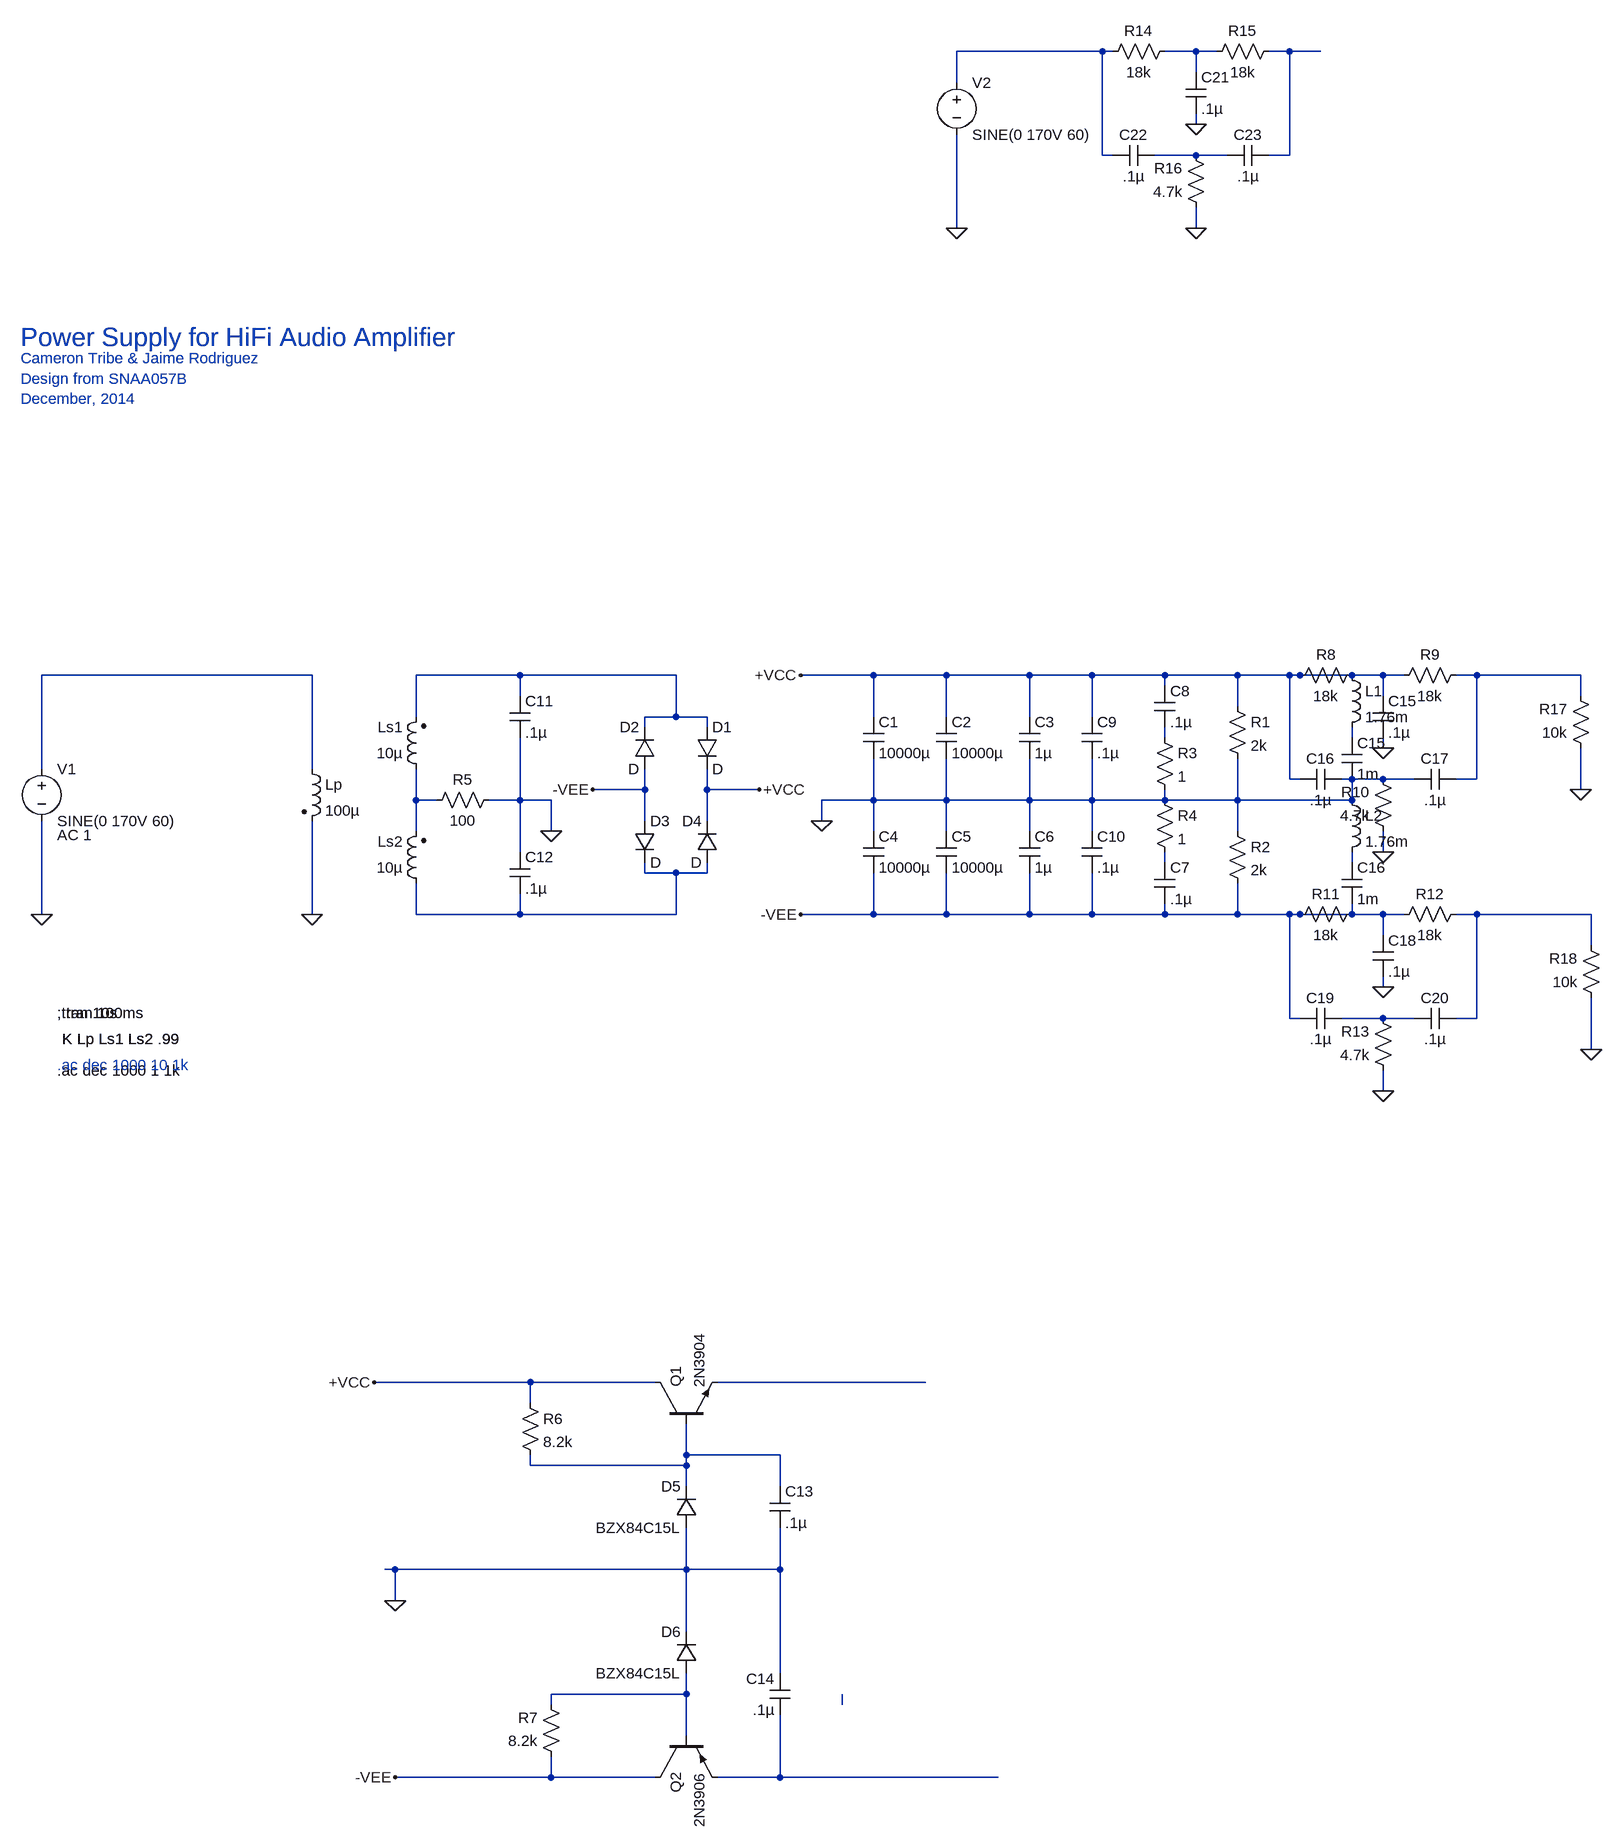
[diagram p0: schematic Power Supply.asc]
Power Supply.asc, the LTspice schematic file:
Version 4
<<<<<<< Updated upstream
SHEET 1 2192 1984
=======
SHEET 1 2484 1984
WIRE 1712 -784 1488 -784
WIRE 1728 -784 1712 -784
WIRE 1856 -784 1808 -784
WIRE 1888 -784 1856 -784
WIRE 2000 -784 1968 -784
WIRE 2048 -784 2000 -784
WIRE 1856 -752 1856 -784
WIRE 1488 -736 1488 -784
WIRE 1856 -672 1856 -688
WIRE 1712 -624 1712 -784
WIRE 1728 -624 1712 -624
WIRE 1856 -624 1792 -624
WIRE 1904 -624 1856 -624
WIRE 2000 -624 2000 -784
WIRE 2000 -624 1968 -624
WIRE 1488 -512 1488 -656
WIRE 1856 -512 1856 -544
>>>>>>> Stashed changes
WIRE 496 176 80 176
WIRE 816 176 656 176
WIRE 1056 176 816 176
WIRE 1360 176 1248 176
WIRE 1472 176 1360 176
WIRE 1600 176 1472 176
WIRE 1696 176 1600 176
WIRE 1808 176 1696 176
WIRE 1920 176 1808 176
<<<<<<< Updated upstream
WIRE 2096 176 1920 176
=======
WIRE 2000 176 1920 176
WIRE 2016 176 2000 176
WIRE 2144 176 2096 176
WIRE 2176 176 2144 176
WIRE 2288 176 2256 176
WIRE 2448 176 2288 176
>>>>>>> Stashed changes
WIRE 1808 192 1808 176
WIRE 816 208 816 176
WIRE 2144 208 2144 176
WIRE 2448 208 2448 176
WIRE 1920 224 1920 176
WIRE 656 240 656 176
WIRE 1056 240 1056 176
WIRE 1056 240 1008 240
WIRE 1104 240 1056 240
WIRE 1360 240 1360 176
WIRE 1472 240 1472 176
WIRE 1600 240 1600 176
WIRE 1696 240 1696 176
WIRE 1008 256 1008 240
WIRE 1104 256 1104 240
WIRE 1808 272 1808 256
<<<<<<< Updated upstream
WIRE 2096 272 2096 256
=======
WIRE 2144 288 2144 272
>>>>>>> Stashed changes
WIRE 80 320 80 176
WIRE 496 320 496 176
WIRE 2000 336 2000 176
WIRE 2016 336 2000 336
WIRE 2144 336 2080 336
WIRE 2192 336 2144 336
WIRE 2288 336 2288 176
WIRE 2288 336 2256 336
WIRE 1008 352 1008 320
WIRE 1008 352 928 352
WIRE 1104 352 1104 320
WIRE 1184 352 1104 352
WIRE 2448 352 2448 288
WIRE 656 368 656 320
WIRE 688 368 656 368
WIRE 816 368 816 272
WIRE 816 368 768 368
WIRE 864 368 816 368
WIRE 1360 368 1360 304
WIRE 1360 368 1280 368
WIRE 1472 368 1472 304
WIRE 1472 368 1360 368
WIRE 1600 368 1600 304
WIRE 1600 368 1472 368
WIRE 1696 368 1696 304
WIRE 1696 368 1600 368
WIRE 1808 368 1808 352
WIRE 1808 368 1696 368
WIRE 1920 368 1920 304
WIRE 1920 368 1808 368
<<<<<<< Updated upstream
WIRE 2016 368 1920 368
WIRE 2096 368 2096 336
WIRE 2096 368 2016 368
=======
>>>>>>> Stashed changes
WIRE 1008 400 1008 352
WIRE 1104 400 1104 352
WIRE 1280 400 1280 368
WIRE 656 416 656 368
WIRE 864 416 864 368
WIRE 1360 416 1360 368
WIRE 1472 416 1472 368
WIRE 1600 416 1600 368
WIRE 1696 416 1696 368
WIRE 1920 416 1920 368
WIRE 816 448 816 368
WIRE 2144 448 2144 416
WIRE 1808 464 1808 448
WIRE 2096 464 2096 448
WIRE 1008 480 1008 464
WIRE 1056 480 1008 480
WIRE 1104 480 1104 464
WIRE 1104 480 1056 480
WIRE 80 544 80 400
WIRE 496 544 496 400
WIRE 656 544 656 496
WIRE 816 544 816 512
WIRE 816 544 656 544
WIRE 1056 544 1056 480
WIRE 1056 544 816 544
WIRE 1360 544 1360 480
WIRE 1360 544 1248 544
WIRE 1472 544 1472 480
WIRE 1472 544 1360 544
WIRE 1600 544 1600 480
WIRE 1600 544 1472 544
WIRE 1696 544 1696 480
WIRE 1696 544 1600 544
WIRE 1808 544 1808 528
WIRE 1808 544 1696 544
WIRE 1920 544 1920 496
WIRE 1920 544 1808 544
<<<<<<< Updated upstream
WIRE 2096 544 2096 528
WIRE 2096 544 1920 544
=======
WIRE 2000 544 1920 544
WIRE 2016 544 2000 544
WIRE 2144 544 2096 544
WIRE 2176 544 2144 544
WIRE 2288 544 2256 544
WIRE 2464 544 2288 544
WIRE 2144 576 2144 544
WIRE 2464 592 2464 544
WIRE 2144 656 2144 640
WIRE 2000 704 2000 544
WIRE 2016 704 2000 704
WIRE 2144 704 2080 704
WIRE 2192 704 2144 704
WIRE 2288 704 2288 544
WIRE 2288 704 2256 704
WIRE 2464 752 2464 672
WIRE 2144 816 2144 784
>>>>>>> Stashed changes
WIRE 832 1264 592 1264
WIRE 1024 1264 832 1264
WIRE 1440 1264 1120 1264
WIRE 832 1296 832 1264
WIRE 1072 1376 1072 1328
WIRE 1216 1376 1072 1376
WIRE 832 1392 832 1376
WIRE 1072 1392 1072 1376
WIRE 1072 1392 832 1392
WIRE 1072 1424 1072 1392
WIRE 1216 1424 1216 1376
WIRE 624 1552 608 1552
WIRE 1072 1552 1072 1488
WIRE 1072 1552 624 1552
WIRE 1216 1552 1216 1488
WIRE 1216 1552 1072 1552
WIRE 624 1600 624 1552
WIRE 1072 1648 1072 1552
WIRE 1216 1712 1216 1552
WIRE 1072 1744 1072 1712
WIRE 1072 1744 864 1744
WIRE 864 1760 864 1744
WIRE 1312 1760 1312 1744
WIRE 1072 1808 1072 1744
WIRE 864 1872 864 1840
WIRE 864 1872 624 1872
WIRE 1024 1872 864 1872
WIRE 1216 1872 1216 1776
WIRE 1216 1872 1120 1872
WIRE 1552 1872 1216 1872
FLAG 1184 352 +VCC
FLAG 928 352 -VEE
FLAG 1248 176 +VCC
FLAG 1248 544 -VEE
FLAG 80 544 0
FLAG 496 544 0
FLAG 864 416 0
FLAG 592 1264 +VCC
FLAG 624 1872 -VEE
FLAG 624 1600 0
FLAG 1280 400 0
FLAG 1856 -672 0
FLAG 1856 -512 0
FLAG 1488 -512 0
FLAG 2144 288 0
FLAG 2144 448 0
FLAG 2144 656 0
FLAG 2144 816 0
FLAG 2448 352 0
FLAG 2464 752 0
SYMBOL voltage 80 304 R0
WINDOW 123 24 118 Left 2
SYMATTR InstName V1
SYMATTR Value SINE(0 170V 60)
SYMATTR SpiceLine Rser=.00001
SYMATTR Value2 AC 1
SYMBOL diode 1088 256 R0
SYMATTR InstName D1
SYMBOL diode 1024 320 R180
WINDOW 0 24 64 Left 2
WINDOW 3 24 0 Left 2
SYMATTR InstName D2
SYMBOL diode 992 400 R0
SYMATTR InstName D3
SYMBOL diode 1120 464 R180
WINDOW 0 24 64 Left 2
WINDOW 3 24 0 Left 2
SYMATTR InstName D4
SYMBOL ind2 480 304 R0
SYMATTR InstName Lp
SYMATTR Value 100µ
SYMATTR Type ind
SYMBOL ind2 672 336 R180
WINDOW 0 36 80 Left 2
WINDOW 3 36 40 Left 2
SYMATTR InstName Ls1
SYMATTR Value 10µ
SYMATTR Type ind
SYMBOL ind2 672 512 R180
WINDOW 0 36 80 Left 2
WINDOW 3 36 40 Left 2
SYMATTR InstName Ls2
SYMATTR Value 10µ
SYMATTR Type ind
SYMBOL cap 1344 240 R0
SYMATTR InstName C1
SYMATTR Value 10000µ
SYMBOL cap 1456 240 R0
SYMATTR InstName C2
SYMATTR Value 10000µ
SYMBOL cap 1584 240 R0
SYMATTR InstName C3
SYMATTR Value 1µ
SYMBOL cap 1344 416 R0
SYMATTR InstName C4
SYMATTR Value 10000µ
SYMBOL cap 1456 416 R0
SYMATTR InstName C5
SYMATTR Value 10000µ
SYMBOL cap 1584 416 R0
SYMATTR InstName C6
SYMATTR Value 1µ
SYMBOL cap 1792 464 R0
SYMATTR InstName C7
SYMATTR Value .1µ
SYMBOL cap 1792 192 R0
SYMATTR InstName C8
SYMATTR Value .1µ
SYMBOL res 1904 208 R0
SYMATTR InstName R1
SYMATTR Value 2k
SYMBOL res 1904 400 R0
SYMATTR InstName R2
SYMATTR Value 2k
SYMBOL res 1792 256 R0
SYMATTR InstName R3
SYMATTR Value 1
SYMBOL res 1792 352 R0
SYMATTR InstName R4
SYMATTR Value 1
SYMBOL cap 1680 240 R0
SYMATTR InstName C9
SYMATTR Value .1µ
SYMBOL cap 1680 416 R0
SYMATTR InstName C10
SYMATTR Value .1µ
SYMBOL res 784 352 R90
WINDOW 0 0 56 VBottom 2
WINDOW 3 32 56 VTop 2
SYMATTR InstName R5
SYMATTR Value 100
SYMBOL cap 800 208 R0
SYMATTR InstName C11
SYMATTR Value .1µ
SYMBOL cap 800 448 R0
SYMATTR InstName C12
SYMATTR Value .1µ
SYMBOL res 816 1280 R0
SYMATTR InstName R6
SYMATTR Value 8.2k
SYMBOL npn 1024 1328 R270
SYMATTR InstName Q1
SYMATTR Value 2N3904
SYMBOL diode 1088 1488 R180
WINDOW 0 24 64 Left 2
WINDOW 3 24 0 Left 2
SYMATTR InstName D5
SYMATTR Value BZX84C15L
SYMBOL cap 1200 1424 R0
SYMATTR InstName C13
SYMATTR Value .1µ
SYMBOL res 880 1856 R180
WINDOW 0 36 76 Left 2
WINDOW 3 36 40 Left 2
SYMATTR InstName R7
SYMATTR Value 8.2k
SYMBOL diode 1088 1712 R180
WINDOW 0 24 64 Left 2
WINDOW 3 24 0 Left 2
SYMATTR InstName D6
SYMATTR Value BZX84C15L
SYMBOL cap 1232 1776 R180
WINDOW 0 24 56 Left 2
WINDOW 3 24 8 Left 2
SYMATTR InstName C14
SYMATTR Value .1µ
SYMBOL pnp 1024 1808 M90
SYMATTR InstName Q2
SYMATTR Value 2N3906
<<<<<<< Updated upstream
SYMBOL cap 2080 272 R0
SYMATTR InstName C15
SYMATTR Value 1m
SYMBOL ind 2080 160 R0
SYMATTR InstName L1
SYMATTR Value 1.76m
SYMBOL cap 2080 464 R0
SYMATTR InstName C16
SYMATTR Value 1m
SYMBOL ind 2080 352 R0
SYMATTR InstName L2
SYMATTR Value 1.76m
TEXT 112 736 Left 2 !K Lp Ls1 Ls2 .99
TEXT 104 696 Left 2 !;.tran 100ms
TEXT 48 -344 Left 4 ;Power Supply for HiFi Audio Amplifier
TEXT 48 -312 Left 2 ;Cameron Tribe & Jaime Rodriguez\nDesign from SNAA057B\nDecember, 2014
TEXT 104 784 Left 2 !.ac dec 1000 1 1k
=======
SYMBOL res 1824 -800 R90
WINDOW 0 0 56 VBottom 2
WINDOW 3 32 56 VTop 2
SYMATTR InstName R14
SYMATTR Value 18k
SYMBOL res 1984 -800 R90
WINDOW 0 0 56 VBottom 2
WINDOW 3 32 56 VTop 2
SYMATTR InstName R15
SYMATTR Value 18k
SYMBOL res 1872 -528 R180
WINDOW 0 36 76 Left 2
WINDOW 3 36 40 Left 2
SYMATTR InstName R16
SYMATTR Value 4.7k
SYMBOL cap 1840 -752 R0
SYMATTR InstName C21
SYMATTR Value .1µ
SYMBOL cap 1792 -640 R90
WINDOW 0 0 32 VBottom 2
WINDOW 3 32 32 VTop 2
SYMATTR InstName C22
SYMATTR Value .1µ
SYMBOL cap 1968 -640 R90
WINDOW 0 0 32 VBottom 2
WINDOW 3 32 32 VTop 2
SYMATTR InstName C23
SYMATTR Value .1µ
SYMBOL voltage 1488 -752 R0
SYMATTR InstName V2
SYMATTR Value SINE(0 170V 60)
SYMATTR SpiceLine Rser=.00001
SYMATTR Value2 AC 1
SYMBOL res 2112 160 R90
WINDOW 0 0 56 VBottom 2
WINDOW 3 32 56 VTop 2
SYMATTR InstName R8
SYMATTR Value 18k
SYMBOL res 2272 160 R90
WINDOW 0 0 56 VBottom 2
WINDOW 3 32 56 VTop 2
SYMATTR InstName R9
SYMATTR Value 18k
SYMBOL res 2160 432 R180
WINDOW 0 36 76 Left 2
WINDOW 3 36 40 Left 2
SYMATTR InstName R10
SYMATTR Value 4.7k
SYMBOL cap 2128 208 R0
SYMATTR InstName C15
SYMATTR Value .1µ
SYMBOL cap 2080 320 R90
WINDOW 0 0 32 VBottom 2
WINDOW 3 32 32 VTop 2
SYMATTR InstName C16
SYMATTR Value .1µ
SYMBOL cap 2256 320 R90
WINDOW 0 0 32 VBottom 2
WINDOW 3 32 32 VTop 2
SYMATTR InstName C17
SYMATTR Value .1µ
SYMBOL res 2112 528 R90
WINDOW 0 0 56 VBottom 2
WINDOW 3 32 56 VTop 2
SYMATTR InstName R11
SYMATTR Value 18k
SYMBOL res 2272 528 R90
WINDOW 0 0 56 VBottom 2
WINDOW 3 32 56 VTop 2
SYMATTR InstName R12
SYMATTR Value 18k
SYMBOL res 2160 800 R180
WINDOW 0 36 76 Left 2
WINDOW 3 36 40 Left 2
SYMATTR InstName R13
SYMATTR Value 4.7k
SYMBOL cap 2128 576 R0
SYMATTR InstName C18
SYMATTR Value .1µ
SYMBOL cap 2080 688 R90
WINDOW 0 0 32 VBottom 2
WINDOW 3 32 32 VTop 2
SYMATTR InstName C19
SYMATTR Value .1µ
SYMBOL cap 2256 688 R90
WINDOW 0 0 32 VBottom 2
WINDOW 3 32 32 VTop 2
SYMATTR InstName C20
SYMATTR Value .1µ
SYMBOL res 2464 304 R180
WINDOW 0 36 76 Left 2
WINDOW 3 36 40 Left 2
SYMATTR InstName R17
SYMATTR Value 10k
SYMBOL res 2480 688 R180
WINDOW 0 36 76 Left 2
WINDOW 3 36 40 Left 2
SYMATTR InstName R18
SYMATTR Value 10k
TEXT 112 736 Left 2 !K Lp Ls1 Ls2 .99
TEXT 104 696 Left 2 !.tran 10s
TEXT 48 -344 Left 4 ;Power Supply for HiFi Audio Amplifier
TEXT 48 -312 Left 2 ;Cameron Tribe & Jaime Rodriguez\nDesign from SNAA057B\nDecember, 2014
TEXT 104 776 Left 2 ;.ac dec 1000 10 1k
>>>>>>> Stashed changes

The netlist it stands for:
* Power Supply.asc
V1 N005 0 SINE(0 170V 60) AC 1 Rser=.00001
D1 N006 +VCC D
D2 -VEE N006 D
D3 -VEE N013 D
D4 N013 +VCC D
Lp N005 0 100µ
Ls1 N010 N006 10µ
Ls2 N013 N010 10µ
C1 +VCC 0 10000µ
C2 +VCC 0 10000µ
C3 +VCC 0 1µ
C4 0 -VEE 10000µ
C5 0 -VEE 10000µ
C6 0 -VEE 1µ
C7 N011 -VEE .1µ
C8 +VCC N008 .1µ
R1 +VCC 0 2k
R2 0 -VEE 2k
R3 N008 0 1
R4 0 N011 1
C9 +VCC 0 .1µ
C10 0 -VEE .1µ
R5 0 N010 100
C11 N006 0 .1µ
C12 0 N013 .1µ
R6 +VCC N017 8.2k
Q1 +VCC N017 N016 0 2N3904
D5 0 N017 BZX84C15L
C13 N017 0 .1µ
R7 -VEE N018 8.2k
D6 N018 0 BZX84C15L
C14 N020 0 .1µ
Q2 -VEE N018 N020 0 2N3906
C15 N009 0 1m
L1 +VCC N009 1.76m
C16 N012 -VEE 1m
L2 0 N012 1.76m
R14 N002 N001 18k
R15 N003 N002 18k
R16 0 N004 4.7k
C21 N002 0 .1µ
C22 N004 N001 .1µ
C23 N003 N004 .1µ
V2 N001 0 SINE(0 170V 60) AC 1 Rser=.00001
R8 +VCC +VCC 18k
R9 N007 +VCC 18k
R10 0 0 4.7k
C15 +VCC 0 .1µ
C16 0 +VCC .1µ
C17 N007 0 .1µ
R11 -VEE -VEE 18k
R12 N014 -VEE 18k
R13 0 N015 4.7k
C18 -VEE 0 .1µ
C19 N015 -VEE .1µ
C20 N014 N015 .1µ
R17 0 N007 10k
R18 0 N014 10k
.model D D
.lib standard.dio
.model NPN NPN
.model PNP PNP
.lib standard.bjt
K Lp Ls1 Ls2 .99
;.tran 100ms
* Power Supply for HiFi Audio Amplifier
* Cameron Tribe & Jaime Rodriguez
* Design from SNAA057B
* December, 2014
.ac dec 1000 1 1k
K Lp Ls1 Ls2 .99
.tran 10s
* Power Supply for HiFi Audio Amplifier
* Cameron Tribe & Jaime Rodriguez
* Design from SNAA057B
* December, 2014
* .ac dec 1000 10 1k
.backanno
.end